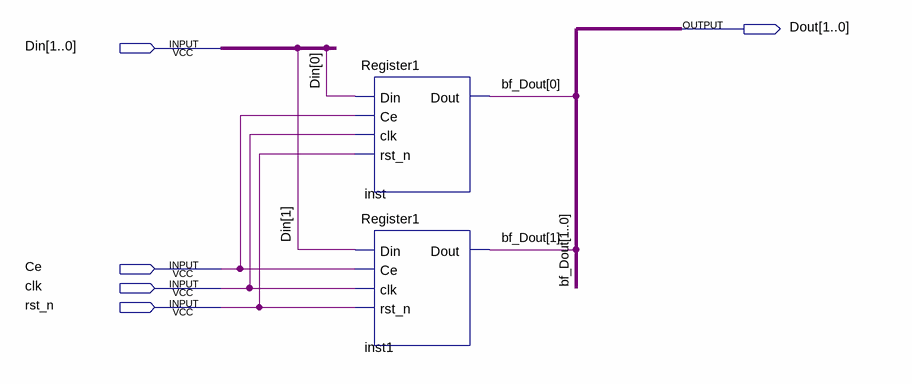
[diagram p0: schematic sheet]
// Quartus schematic Register2.bdf as structural Verilog: 2 symbols, 5 pins
module Register2 (
  input  [1:0] Din,
  input  Ce,
  input  clk,
  input  rst_n,
  output [1:0] Dout
);

  Register1 inst (.Din(Din[0]), .Ce(Ce), .clk(clk), .rst_n(rst_n), .Dout(Dout[0]));
  Register1 inst1 (.Din(Din[1]), .Ce(Ce), .clk(clk), .rst_n(rst_n), .Dout(Dout[1]));

  // Other names for the same wires on the sheet: bf_Dout[1:0] = Dout
endmodule
